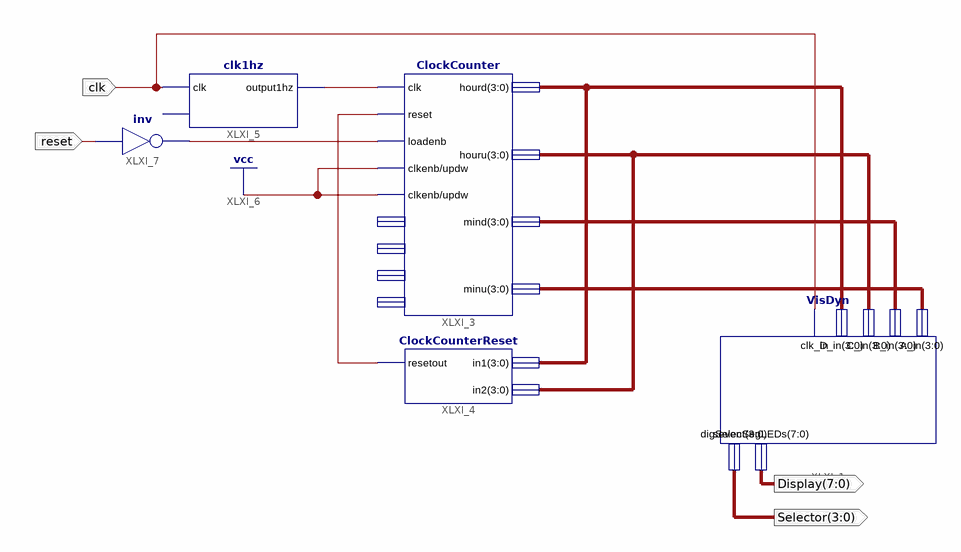
[diagram p0: schematic sheet 1]
// Xilinx ISE schematic topmodule.sch (spartan3e) as structural Verilog: 5 symbols, 4 ports
module topmodule (
  input  clk,
  input  reset,
  output [7:0] Display,
  output [3:0] Selector
);

  wire XLXN_6, XLXN_14, XLXN_34;
  wire [3:0] XLXN_21, XLXN_24, XLXN_25, XLXN_26;

  VisDyn XLXI_1 (
    .A_in(XLXN_26), .B_in(XLXN_25), .C_in(XLXN_24), .D_in(XLXN_21), .clk_in(clk), .sevenSegLEDs(Display),
    .digSelect(Selector));
  ClockCounter XLXI_3 (
    .clk(XLXN_34), .reset(XLXN_6), .loadenb(XLXN_14), .clkenb(1'b1), .updw(1'b1), .hourd(XLXN_21),
    .houru(XLXN_24), .mind(XLXN_25), .minu(XLXN_26));  // open: load0, load1, load2, load3
  ClockCounterReset XLXI_4 (.in1(XLXN_21), .in2(XLXN_24), .resetout(XLXN_6));
  clk1hz XLXI_5 (.clk(clk), .output1hz(XLXN_34));  // open: reset
  not XLXI_7 (XLXN_14, reset);
endmodule
